# Altium schematic sheet SDEC944-xD_Arrosage_(detect_pluie+commande_vanne).SchDoc: Arrosage (detect pluie+commande vanne)
size 393 x 270 mm; CompanyName: Seccom; Address1: 521, rue du capt. François Garbit; Address2: 69440 Mornant; Address3: seccom@seccom.fr; Address4: www.seccom.fr; DocumentNumber: 13; SheetNumber: 13; SheetTotal: 22; PageSetup: Record=PageOptions|CenterHorizontal=True|CenterVertical=True|PrintScale=0.74|XCorrection=1.00|YCorrection=1.00|PrintKind=0|BorderSize=5000000|LeftOffset=0|BottomOffset=0|Orientation=2|PaperLength=1000|PaperWidth=1000|Scale=100|PaperSource=7|PrintQuality=-4|MediaType=1|DitherType=10|PaperKind=A4|PrintScaleMode=1
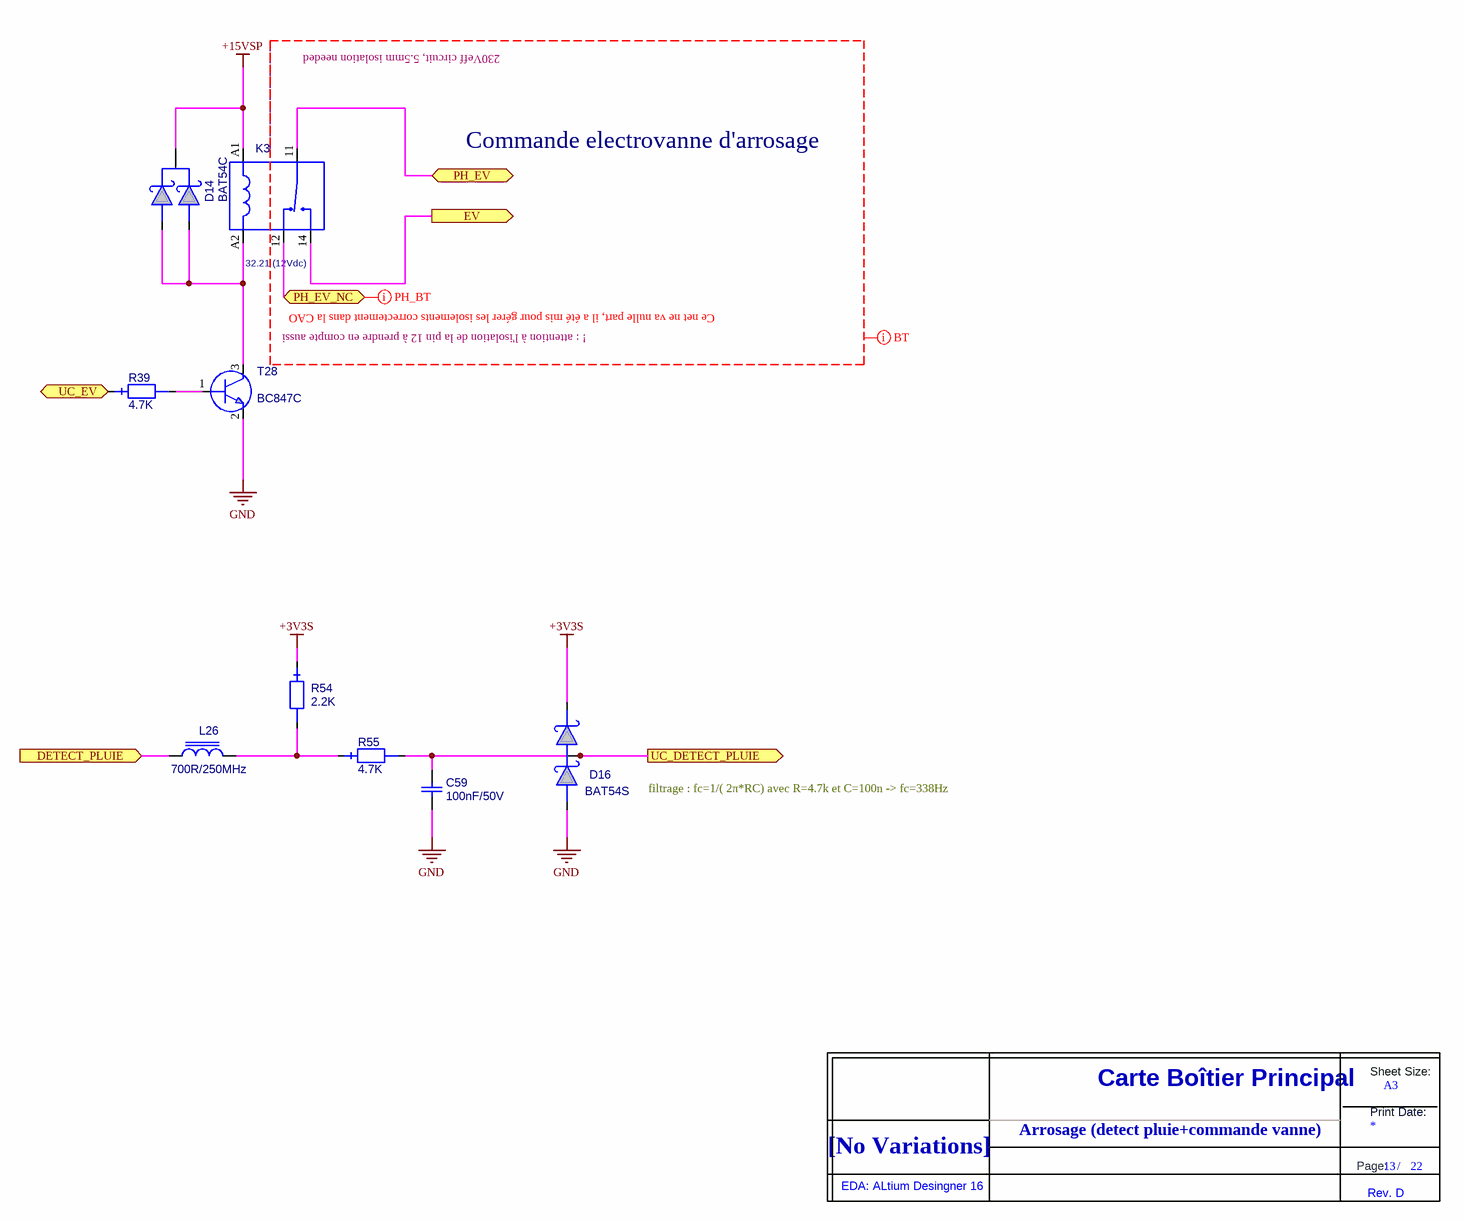
[diagram p0: SDEC944-xD_Arrosage_(detect_pluie+commande_vanne).SchDoc]

## Parts
C59  value 100nF/50V  [0603_ReflowSoldering_CAP]  (hidden comment: C_0603_X7R_10%_100N-50V)
D14  BAT54C  [SOT23_3L_ReflowSoldering]
D16  BAT54S  [SOT23_3L_ReflowSoldering]
K3  value 32.21 (12Vdc)  [RELAY_FINDER_32.21]  (hidden comment: RELAY_12VDC_1RT_32.21)
L26  value 700R/250MHz  [0603_ReflowSoldering_CAP]  (hidden comment: IND_FERRITE_0603_742792643)
R39  value 4.7K  [0603_ReflowSoldering_RES]  (hidden comment: RES_0603_1%_100PPM_4.7K)
R54  value 2.2K  [0603_ReflowSoldering_RES]  (hidden comment: RES_0603_1%_100PPM_2.2K)
R55  value 4.7K  [0603_ReflowSoldering_RES]  (hidden comment: RES_0603_1%_100PPM_4.7K)
T28  BC847C  [SOT23_3L_ReflowSoldering]
Title_new  DNI  (value not drawn)  (graphical)

## Ports
DETECT_PLUIE (in), EV (out), PH_EV (bidir), PH_EV_NC (bidir), UC_DETECT_PLUIE (out), UC_EV (in)

## Nets
+3V3S: D16.2 R54.1
+15VSP: D14.3 K3.A1
GND: C59.2 D16.1 T28.2(E)
DETECT_PLUIE: L26.1 ; port DETECT_PLUIE
EV: K3.14(NO) ; port EV
PH_EV: K3.11(COM) ; port PH_EV
PH_EV_NC: K3.12(NC) ; port PH_EV_NC
UC_DETECT_PLUIE: C59.1 D16.3 R55.2 ; port UC_DETECT_PLUIE
UC_EV: R39.1 ; port UC_EV
NetD14_1: D14.1 D14.2 K3.A2 T28.3(C)
NetL26_2: L26.2 R54.2 R55.1
NetR39_2: R39.2 T28.1(B)

## Layout directives
net class BT: (no net found under the mark)
net class PH_BT: PH_EV_NC

## Notes on the sheet
- 230Veff circuit, 5.5mm isolation needed
- Commande electrovanne d'arrosage
- Ce net ne va nulle part, il a été mis pour gérer les isolements correctement dans la CAO
- ! : attention à l'isolation de la pin 12 à prendre en compte aussi
- filtrage : fc=1/( 2π*RC) avec R=4.7k et C=100n -> fc=338Hz
- Arrosage (detect pluie+commande vanne)
- (in symbol Title_new) Sheet Size:; Carte Boîtier Principal; A3; Print Date:; [No Variations]; Page:; /; EDA: ALtium Desingner 16; Rev. D

## Library data of the parts
C59 = C_0603_X7R_10%_100N-50V: Condensateur céramique, X7R, 10%, CMS 0603, 100nF/50V; Creation: FB (29/02/12); Boitier: 0603; Remarque: {Remarque}; Fabricant: Kemet; Ref Fab: C0603C104K5RAC; Coeff: 1; ComponentLink1URL: O:\_Documentation\Datasheets\Kemet\Condos_Ceramic_CMS.pdf; ComponentLink2URL: o:\_Documentation\Datasheets\_BOITIERS\PASSIF_CMS\; Config: *; ComponentLink1Description: Datasheet; ComponentLink2Description: Datasheet Boitier; Supplier 1: Farnell; Supplier Part Number 1: 1288255
D14 = BAT54C: Diode Schottky double, BAT54 cathode com, Vrrm=30V, If=300mA, Vf=0.4Vmax, CMS; Creation: LJ (14/05/02); Reference: 000597/00; Boitier: SOT23_3L; Remarque: {Remarque}; Coeff: 1; Fabricant: NXP; Verification: LJ (14/05/02); ComponentLink1URL: O:\_Documentation\Datasheets\NXP\BAT54_series.pdf; ComponentLink2URL: o:\_Documentation\Datasheets\_BOITIERS\ACTIF_CMS\SOT\SOT_23_3P_(Schneider).PDF; Config: *; ComponentLink1Description: Datasheet; ComponentLink2Description: Datasheet Boitier; Ref Fab: BAT54C; Supplier 1: Farnell; Supplier Part Number 1: 1081192; Value: BAT54C
D16 = BAT54S: Diode Schottky double, BAT54 en série, Vrrm=30V, If=200mA, Vf=0.4Vmax, CMS; Creation: JMP 05/09/2002; Verification: GO (26/09/02); Reference: 000206/00; Boitier: SOT23_3L; Remarque: {Remarque}; Coeff: 1; Fabricant: NXP; ComponentLink1URL: O:\_Documentation\Datasheets\NXP\BAT54_series.pdf; ComponentLink2URL: o:\_Documentation\Datasheets\_BOITIERS\ACTIF_CMS\SOT\SOT_23_3P_(Schneider).PDF; Config: *; ComponentLink1Description: Datasheet; ComponentLink2Description: Datasheet Boitier; Ref Fab: BAT54S; Supplier 1: Farnell; Supplier Part Number 1: 1081194; Value: BAT54S; Supplier 2: Mouser; Supplier Part Number 2: 771-BAT54S-T/R
K3 = RELAY_12VDC_1RT_32.21: Relais 1RT, 12Vdc, série 32.21, Rc=720R, Sw:250Vac/6A, Ron=? (AgCdO); Creation: CHD (21/03/12); Boitier: 20x10x10.7mm; Remarque: {Remarque}; Fabricant: Finder; Ref Fab: 32.21.7.012.2000; Coeff: 1; ComponentLink1URL: O:\_Documentation\Datasheets\Finder\Relais_Serie_32.pdf; ComponentLink2URL: o:\_Documentation\Datasheets\Finder\; Config: *; ComponentLink1Description: Datasheet; ComponentLink2Description: Datasheet Boitier; Supplier 1: Farnell; Supplier Part Number 1: 1329652
L26 = IND_FERRITE_0603_742792643: Inductance à ferrite multicouches CMS, imp=700R@250MHz, +/-25%, Rdc=350mR, I=400mA; Creation: PDP (02/08/12); Boitier: 0603; Coeff: 1; Fabricant: Wurth Elektronik; ComponentLink1URL: o:\_Documentation\Datasheets\Murata\Ferrite_BLM21P.pdf; Config: *; ComponentLink1Description: Datasheet; ComponentLink2Description: Datasheet Boitier; Ref Fab: 742792643; Supplier 1: Farnell; Supplier Part Number 1: 1800349
R39 R55 = RES_0603_1%_100PPM_4.7K: Résistance, 0.100W, 1%, 100ppm, 75V, 4.7K; Creation: JPL (05/07/12); Boitier: 0603; Remarque: {Remarque}; Fabricant: Vishay; Ref Fab: CRCW06034K70FKEA; Coeff: 1; Verification: *; ComponentLink1URL: O:\_Documentation\Datasheets\Vishay\Resistances_D-CRCWe3.pdf; ComponentLink2URL: o:\_Documentation\Datasheets\_BOITIERS\PASSIF_CMS\; Config: *; ComponentLink1Description: Datasheet; ComponentLink2Description: Datasheet Boitier; Supplier 1: Farnell; Supplier 2: RadioSpares; Supplier Part Number 1: 1469807; Supplier Part Number 2: 6790484
R54 = RES_0603_1%_100PPM_2.2K: Résistance, 0.100W, 1%, 100ppm, 75V, 2.2K; Creation: JPL (05/07/12); Boitier: 0603; Remarque: {Remarque}; Fabricant: Vishay; Ref Fab: CRCW06032K20FKEA; Coeff: 1; Verification: *; ComponentLink1URL: O:\_Documentation\Datasheets\Vishay\Resistances_D-CRCWe3.pdf; ComponentLink2URL: o:\_Documentation\Datasheets\_BOITIERS\PASSIF_CMS\; Config: *; ComponentLink1Description: Datasheet; ComponentLink2Description: Datasheet Boitier; Supplier 1: Farnell; Supplier 2: RadioSpares; Supplier Part Number 1: 1469765; Supplier Part Number 2: 6790112
T28 = BC847C: Transistor NPN, Vce=50V, Ic=0.1A, hfe=420~800, 0.25W, CMS; Creation: GO (08/07/05); Verification: LJ (21/07/05); Reference: 000329/00; Boitier: SOT23_3L; Remarque: Complementaires aux BC856-860; Fabricant: NXP; Coeff: 1; Ref Fab: BC847C; ComponentLink1URL: O:\_Documentation\Datasheets\NXP\BC847.pdf; ComponentLink2URL: o:\_Documentation\Datasheets\_BOITIERS\ACTIF_CMS\SOT\SOT_23_3P_(Schneider).PDF; Config: *; ComponentLink1Description: Datasheet; Value: BC847C; Supplier 1: Farnell; Supplier Part Number 1: 1081235; ComponentLink2Description: Datasheet Boitier
Title_new = Title_new